# EasyEDA schematic schematic.json
TITLE: Sheet_1; REV: 1.0; Date: 2024-07-06; Sheet: 1/1; Drawn By: fatpotato317; Company: Your Company
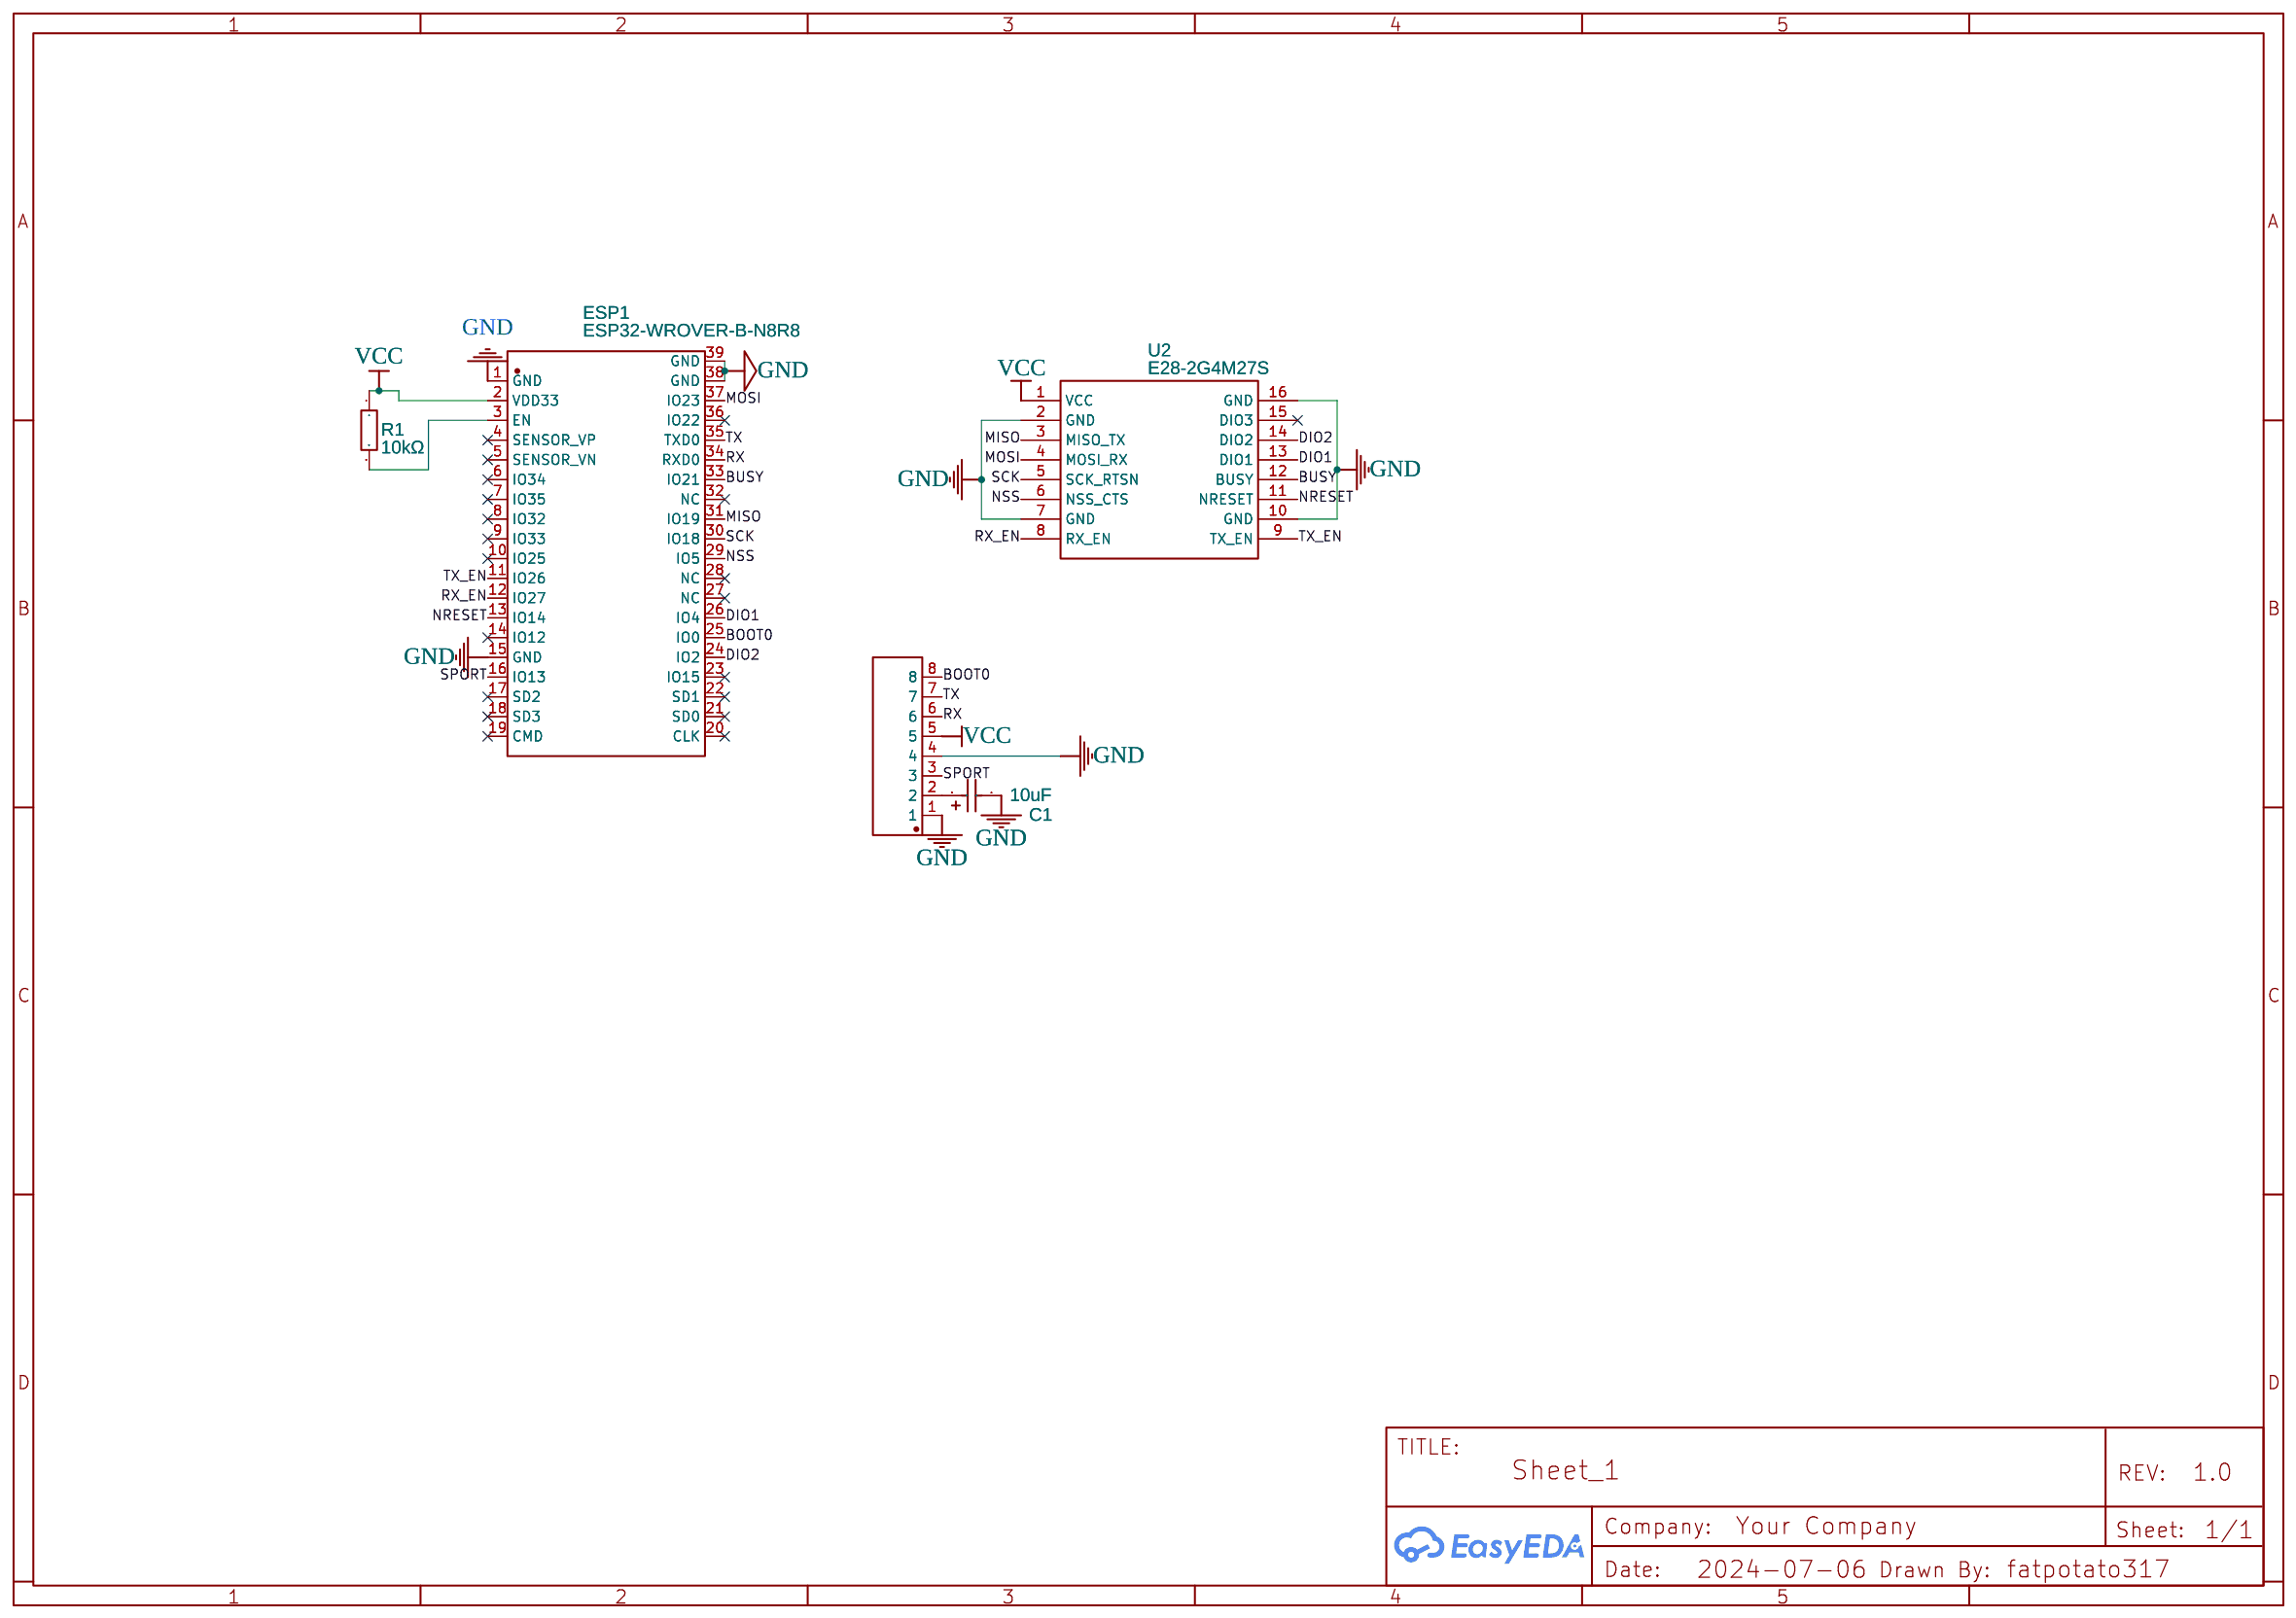
[diagram p0: schematic sheet]

## Parts
C1  10uF  [CAP-SMD_L3.2-W1.6-RD-C7171]
ESP1  ESP32-WROVER-B-N8R8  [WIFIM-SMD_39P-L31.4-W18.0-P1.27]
H1  1.27mm1*8P Straight Headers  Pins  [HEADER8PINS]
R1  10kΩ  [R0603]
U2  E28-2G4M27S  [WIRELM-SMD_E28-2G4M2XS]

## Library data of the parts
C1 = TAJA106K016RNJ: Supplier: LCSC; Manufacturer: Kyocera AVX; Supplier Part: C7171; JLCPCB Part Class: Basic Part; Contributor: whiterabbitstudio2021
ESP1 = ESP32-WROVER-B-N8R8: Supplier: LCSC; Supplier Part: C2973665; Manufacturer: ESPRESSIF(乐鑫); JLCPCB Part Class: Extended Part; Contributor: lcsc
H1 = 1.27mm1*8P Straight Headers  Pins: Supplier Part: C28952; Manufacturer Part: 1.27mm1*10P 直 排针; JLCPCB Part Class: Extended Part; Contributor: pcimolai
R1 = 0603WAF1002T5E: Supplier: LCSC; Manufacturer: UNI-ROYAL(厚声); Supplier Part: C25804; JLCPCB Part Class: Basic Part
U2 = E28-2G4M27S: Contributor: LCSC; Supplier: LCSC; Supplier Part: C411312; Manufacturer: EBYTE(亿佰特); JLCPCB Part Class: Extended Part

## Nets
GND: C1.2 ESP1.1(GND) ESP1.15(GND) ESP1.38(GND) ESP1.39(GND) H1.1 H1.4 U2.2(GND) U2.7(GND) U2.10(GND) U2.16(GND)
VCC: ESP1.2(VDD33) H1.5 R1.1 U2.1(VCC)
BOOT0: ESP1.25(IO0) H1.8
BUSY: ESP1.33(IO21) U2.12(BUSY)
DIO1: ESP1.26(IO4) U2.13(DIO1)
DIO2: ESP1.24(IO2) U2.14(DIO2)
MISO: ESP1.31(IO19) U2.3(MISO_TX)
MOSI: ESP1.37(IO23) U2.4(MOSI_RX)
NRESET: ESP1.13(IO14) U2.11(NRESET)
NSS: ESP1.29(IO5) U2.6(NSS_CTS)
RX: ESP1.34(RXD0) H1.6
RX_EN: ESP1.12(IO27) U2.8(RX_EN)
SCK: ESP1.30(IO18) U2.5(SCK_RTSN)
SPORT: ESP1.16(IO13) H1.3
TX: ESP1.35(TXD0) H1.7
TX_EN: ESP1.11(IO26) U2.9(TX_EN)
Net-(C1-1): C1.1 H1.2
Net-(ESP1-3): ESP1.3(EN) R1.2

Not connected (* = marked no-connect by the designer): ESP1 4(SENSOR_VP)* 5(SENSOR_VN)* 6(IO34)* 7(IO35)* 8(IO32)* 9(IO33)* 10(IO25)* 14(IO12)* 17(SD2)* 18(SD3)* 19(CMD)* 20(CLK)* 21(SD0)* 22(SD1)* 23(IO15)* 27(NC)* 28(NC)* 32(NC)* 36(IO22)*; U2 15(DIO3)*
